# Altium project DAQ-2-B.PrjPcb
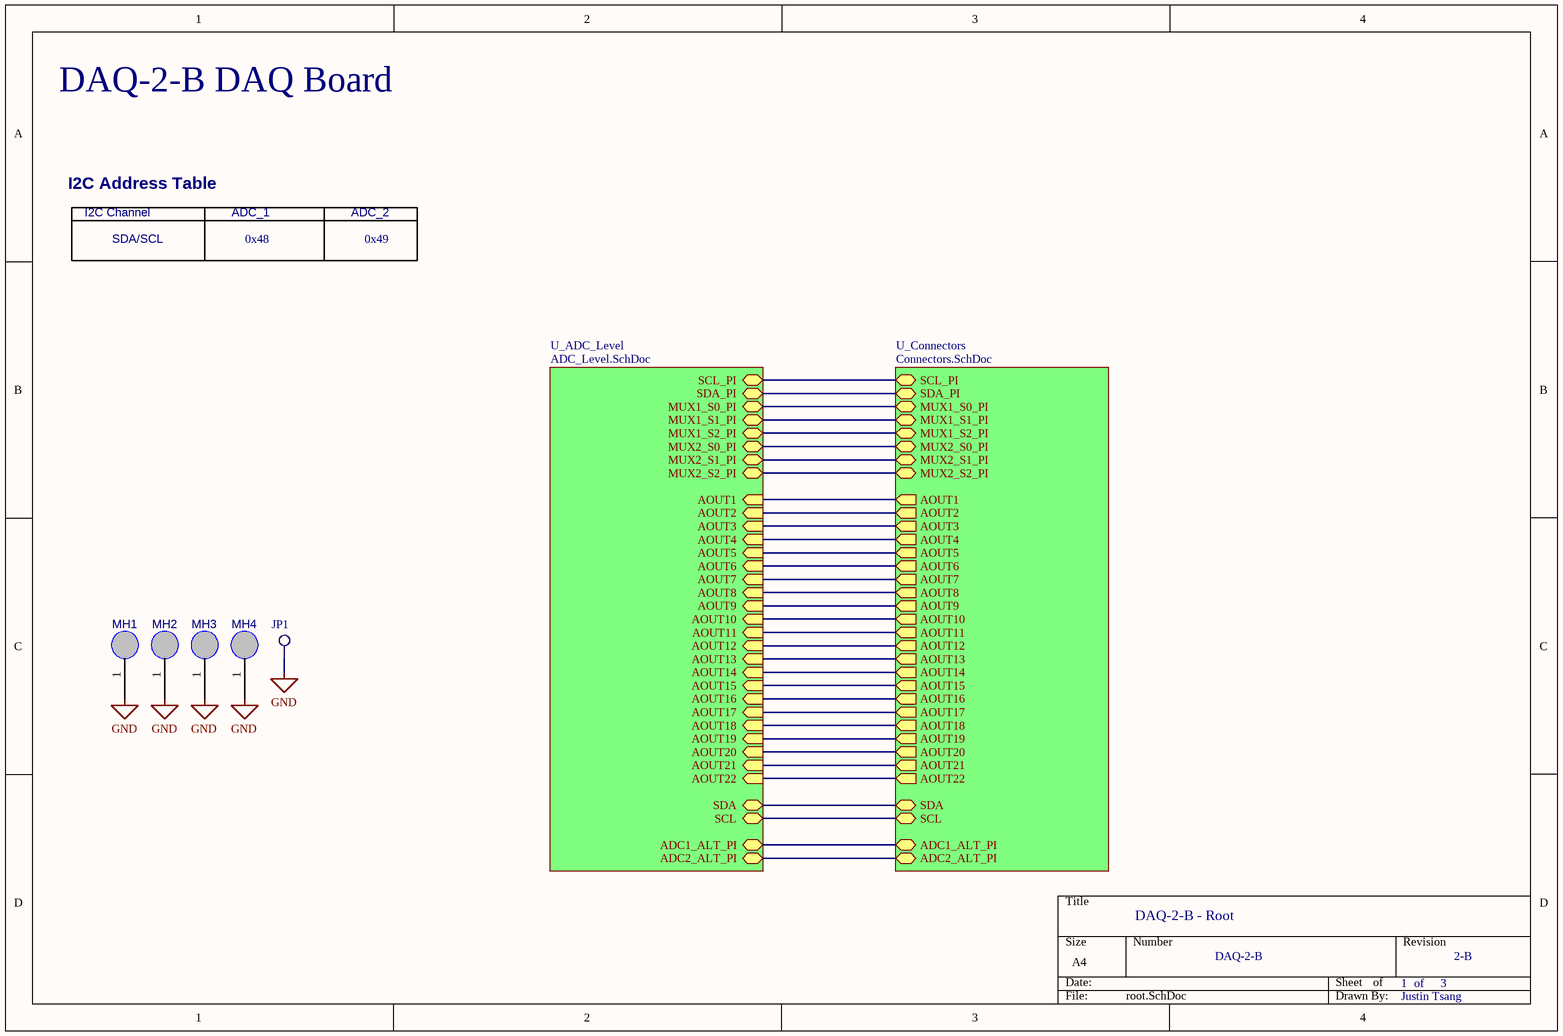
[diagram p0: root.SchDoc]
3 sheets, 79 parts. Net scope: hierarchical (ports join the sheet entries above them; power ports are global).
Board file: DAQ-2-B.PcbDoc
Sheets:
  root.SchDoc
    U_ADC_Level = ADC_Level.SchDoc
    U_Connectors = Connectors.SchDoc

## Sheet root.SchDoc
size A4; SheetNumber: 1; SheetTotal: 3

### Parts
JP1  Testpoint2  [TP2]  (value not drawn)
MH1  MountingHole  [MH2.7MM]  (value not drawn)
MH2  MountingHole  [MH2.7MM]  (value not drawn)
MH3  MountingHole  [MH2.7MM]  (value not drawn)
MH4  MountingHole  [MH2.7MM]  (value not drawn)

### Sub-sheets
U_ADC_Level = ADC_Level.SchDoc: SCL_PI (bidir), SDA_PI (bidir), MUX1_S0_PI (bidir), MUX1_S1_PI (bidir), MUX1_S2_PI (bidir), MUX2_S0_PI (bidir), MUX2_S1_PI (bidir), MUX2_S2_PI (bidir), AOUT17 (in), AOUT14 (in), AOUT7 (in), AOUT8 (in), AOUT16 (in), AOUT18 (in), AOUT9 (in), AOUT6 (in), AOUT12 (in), AOUT10 (in), AOUT19 (in), AOUT13 (in), AOUT1 (in), AOUT15 (in), AOUT20 (in), AOUT2 (in), AOUT3 (in), AOUT11 (in), AOUT5 (in), AOUT4 (in), SCL (bidir), SDA (bidir), AOUT21 (in), AOUT22 (in), ADC1_ALT_PI (bidir), ADC2_ALT_PI (bidir)
U_Connectors = Connectors.SchDoc: SCL_PI (bidir), SDA_PI (bidir), MUX1_S0_PI (bidir), MUX1_S1_PI (bidir), MUX1_S2_PI (bidir), MUX2_S0_PI (bidir), MUX2_S1_PI (bidir), MUX2_S2_PI (bidir), AOUT1 (out), AOUT2 (out), AOUT3 (out), AOUT4 (out), AOUT5 (out), AOUT6 (out), AOUT7 (out), AOUT8 (out), AOUT9 (out), AOUT10 (out), AOUT11 (out), AOUT12 (out), AOUT13 (out), AOUT14 (out), AOUT15 (out), AOUT16 (out), AOUT18 (out), AOUT19 (out), AOUT20 (out), AOUT17 (out), SCL (bidir), SDA (bidir), AOUT22 (out), AOUT21 (out), ADC1_ALT_PI (bidir), ADC2_ALT_PI (bidir)

### Nets
GND: JP1.1 MH1.1 MH2.1 MH3.1 MH4.1
SCL: sheet U_ADC_Level/SDA, sheet U_Connectors/SDA
SDA: sheet U_ADC_Level/SCL, sheet U_Connectors/SCL
NetJ2_3: sheet U_ADC_Level/SDA_PI, sheet U_Connectors/SDA_PI
NetJ2_5: sheet U_ADC_Level/SCL_PI, sheet U_Connectors/SCL_PI
NetJ2_15: sheet U_ADC_Level/MUX2_S0_PI, sheet U_Connectors/MUX2_S0_PI
NetJ2_16: sheet U_ADC_Level/MUX2_S1_PI, sheet U_Connectors/MUX2_S1_PI
NetJ2_18: sheet U_ADC_Level/MUX2_S2_PI, sheet U_Connectors/MUX2_S2_PI
NetJ2_31: sheet U_ADC_Level/MUX1_S1_PI, sheet U_Connectors/MUX1_S1_PI
NetJ2_32: sheet U_ADC_Level/MUX1_S2_PI, sheet U_Connectors/MUX1_S2_PI
NetJ2_36: sheet U_ADC_Level/MUX1_S0_PI, sheet U_Connectors/MUX1_S0_PI
NetJ3_3: sheet U_ADC_Level/AOUT1, sheet U_Connectors/AOUT1
NetJ4_3: sheet U_ADC_Level/AOUT2, sheet U_Connectors/AOUT2
NetJ5_3: sheet U_ADC_Level/AOUT3, sheet U_Connectors/AOUT3
NetJ6_3: sheet U_ADC_Level/AOUT4, sheet U_Connectors/AOUT4
NetJ7_3: sheet U_ADC_Level/AOUT5, sheet U_Connectors/AOUT5
NetJ8_3: sheet U_ADC_Level/AOUT6, sheet U_Connectors/AOUT6
NetJ9_3: sheet U_ADC_Level/AOUT7, sheet U_Connectors/AOUT7
NetJ10_3: sheet U_ADC_Level/AOUT8, sheet U_Connectors/AOUT8
NetJ11_3: sheet U_ADC_Level/AOUT9, sheet U_Connectors/AOUT9
NetJ12_3: sheet U_ADC_Level/AOUT10, sheet U_Connectors/AOUT10
NetJ13_3: sheet U_ADC_Level/AOUT11, sheet U_Connectors/AOUT11
NetJ14_3: sheet U_ADC_Level/AOUT12, sheet U_Connectors/AOUT12
NetJ15_3: sheet U_ADC_Level/AOUT13, sheet U_Connectors/AOUT13
NetJ16_3: sheet U_ADC_Level/AOUT14, sheet U_Connectors/AOUT14
NetJ17_3: sheet U_ADC_Level/AOUT15, sheet U_Connectors/AOUT15
NetJ18_3: sheet U_ADC_Level/AOUT16, sheet U_Connectors/AOUT16
NetJ19_3: sheet U_ADC_Level/AOUT17, sheet U_Connectors/AOUT17
NetJ20_3: sheet U_ADC_Level/AOUT18, sheet U_Connectors/AOUT18
NetJ21_3: sheet U_ADC_Level/AOUT19, sheet U_Connectors/AOUT19
NetJ22_3: sheet U_ADC_Level/AOUT20, sheet U_Connectors/AOUT20
NetJ23_1: sheet U_ADC_Level/AOUT21, sheet U_Connectors/AOUT21
NetJ24_1: sheet U_ADC_Level/AOUT22, sheet U_Connectors/AOUT22
NetJP10_2: sheet U_ADC_Level/ADC2_ALT_PI, sheet U_Connectors/ADC2_ALT_PI
NetJP13_2: sheet U_ADC_Level/ADC1_ALT_PI, sheet U_Connectors/ADC1_ALT_PI

### Notes on the sheet
- DAQ-2-B DAQ Board
- I2C Channel
- SDA/SCL
- I2C Address Table
- 0x48
- ADC_1
- 0x49
- ADC_2
- DAQ-2-B - Root
- DAQ-2-B
- of
- 2-B
- Justin Tsang

### Library data of the parts
JP1 = Testpoint2: Single layer pad TP
MH1-MH4 = MH2.75mm: Mounting hole, 2.7mm; Case: TH

## Sheet ADC_Level.SchDoc
size A4; SheetNumber: 2; SheetTotal: 3
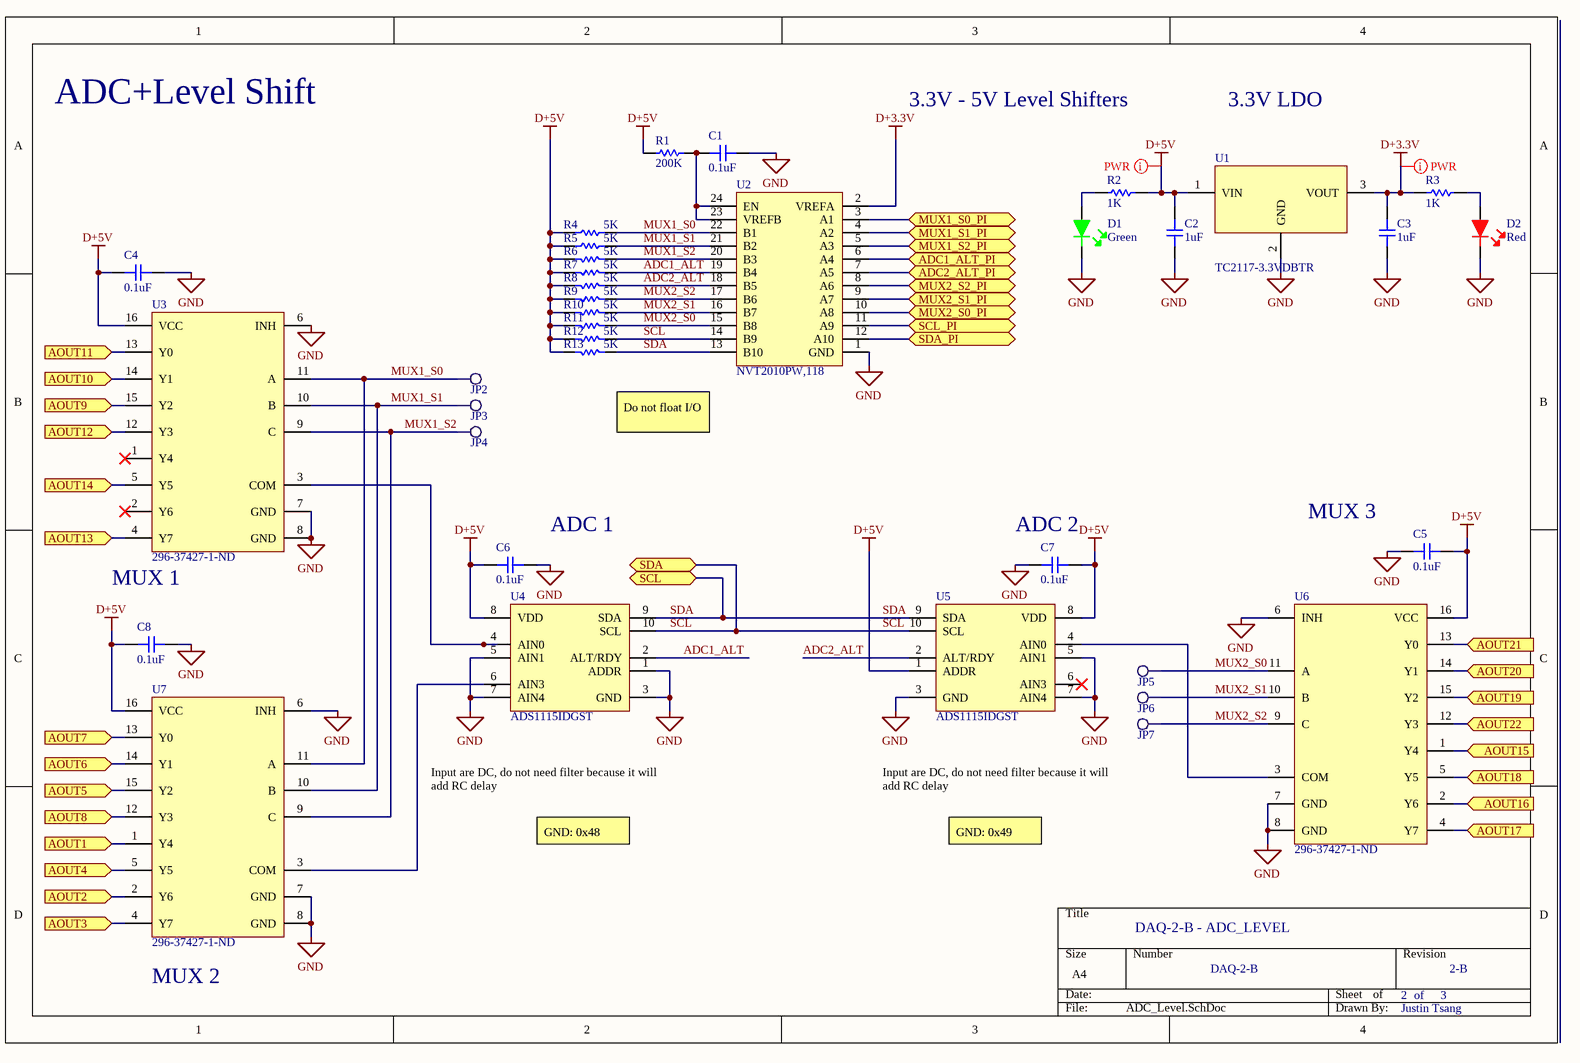
[diagram p1: ADC_Level.SchDoc]

### Parts
C1  0.1uF  [CAP-0603]
C2  1uF  [CAP-0603]
C3  1uF  [CAP-0603]
C4  0.1uF  [CAP-0603]
C5  0.1uF  [CAP-0603]
C6  0.1uF  [CAP-0603]
C7  0.1uF  [CAP-0603]
C8  0.1uF  [CAP-0603]
D1  Green  [LED-0603]
D2  Red  [LED-0603]
JP2  Testpoint2  [TP2]  (value not drawn)
JP3  Testpoint2  [TP2]  (value not drawn)
JP4  Testpoint2  [TP2]  (value not drawn)
JP5  Testpoint2  [TP2]  (value not drawn)
JP6  Testpoint2  [TP2]  (value not drawn)
JP7  Testpoint2  [TP2]  (value not drawn)
R1  200K  [RES-0603]
R2  1K  [RES-0603]
R3  1K  [RES-0603]
R4  5K  [RES-0603]
R5  5K  [RES-0603]
R6  5K  [RES-0603]
R7  5K  [RES-0603]
R8  5K  [RES-0603]
R9  5K  [RES-0603]
R10  5K  [RES-0603]
R11  5K  [RES-0603]
R12  5K  [RES-0603]
R13  5K  [RES-0603]
U1  TC2117-3.3VDBTR  [SOT223]
U2  NVT2010PW,118  [TSSOP65P660X110-24]
U3  296-37427-1-ND  [16-SOIC]
U4  ADS1115IDGST  [VSSOP50P310X310-10P]
U5  ADS1115IDGST  [VSSOP50P310X310-10P]
U6  296-37427-1-ND  [16-SOIC]
U7  296-37427-1-ND  [16-SOIC]

### Ports
ADC1_ALT_PI (bidir), ADC2_ALT_PI (bidir), AOUT1 (in), AOUT2 (in), AOUT3 (in), AOUT4 (in), AOUT5 (in), AOUT6 (in), AOUT7 (in), AOUT8 (in), AOUT9 (in), AOUT10 (in), AOUT11 (in), AOUT12 (in), AOUT13 (in), AOUT14 (in), AOUT15 (in), AOUT16 (in), AOUT17 (in), AOUT18 (in), AOUT19 (in), AOUT20 (in), AOUT21 (in), AOUT22 (in), MUX1_S0_PI (bidir), MUX1_S1_PI (bidir), MUX1_S2_PI (bidir), MUX2_S0_PI (bidir), MUX2_S1_PI (bidir), MUX2_S2_PI (bidir), SCL (bidir), SCL_PI (bidir), SDA (bidir), SDA_PI (bidir)

### Nets
D+3.3V: C3.2 R3.1 U1.3(VOUT) U2.2(VREFA)
D+5V: C2.2 C4.2 C5.2 C6.2 C7.2 C8.2 R1.2 R2.1 R4.1 R5.1 R6.1 R7.1 R8.1 R9.1 R10.1 R11.1 R12.2 R13.1 U1.1(VIN) U3.16(VCC) U4.8(VDD) U5.1(ADDR) U5.8(VDD) U6.16(VCC) U7.16(VCC)
GND: C1.1 C2.1 C3.1 C4.1 C5.1 C6.1 C7.1 C8.1 D1.2 D2.2 U1.2(GND) U2.1(GND) U3.6(INH) U3.7(GND) U3.8(GND) U4.1(ADDR) U4.3(GND) U4.5(AIN1) U4.7(AIN4) U5.3(GND) U5.5(AIN1) U5.7(AIN4) U6.6(INH) U6.7(GND) U6.8(GND) U7.6(INH) U7.7(GND) U7.8(GND)
ADC1_ALT: R7.2 U2.19(B4) U4.2(ALT/RDY)
ADC2_ALT: R8.2 U2.18(B5) U5.2(ALT/RDY)
MUX1_S0: JP2.1 R4.2 U2.22(B1) U3.11(A) U7.11(A)
MUX1_S1: JP3.1 R5.2 U2.21(B2) U3.10(B) U7.10(B)
MUX1_S2: JP4.1 R6.2 U2.20(B3) U3.9(C) U7.9(C)
MUX2_S0: JP5.1 R11.2 U2.15(B8) U6.11(A)
MUX2_S1: JP6.1 R10.2 U2.16(B7) U6.10(B)
MUX2_S2: JP7.1 R9.2 U2.17(B6) U6.9(C)
SCL: R12.1 U2.14(B9) U4.10(SCL) U5.10(SCL) ; port SDA
SDA: R13.2 U2.13(B10) U4.9(SDA) U5.9(SDA) ; port SCL
NetC1_2: C1.2 R1.1 U2.23(VREFB) U2.24(EN)
NetD1_1: D1.1 R2.2
NetD2_1: D2.1 R3.2
NetJ2_3: U2.12(A10) ; port SDA_PI
NetJ2_5: U2.11(A9) ; port SCL_PI
NetJ2_15: U2.10(A8) ; port MUX2_S0_PI
NetJ2_16: U2.9(A7) ; port MUX2_S1_PI
NetJ2_18: U2.8(A6) ; port MUX2_S2_PI
NetJ2_31: U2.4(A2) ; port MUX1_S1_PI
NetJ2_32: U2.5(A3) ; port MUX1_S2_PI
NetJ2_36: U2.3(A1) ; port MUX1_S0_PI
NetJ3_3: U7.1(Y4) ; port AOUT1
NetJ4_3: U7.2(Y6) ; port AOUT2
NetJ5_3: U7.4(Y7) ; port AOUT3
NetJ6_3: U7.5(Y5) ; port AOUT4
NetJ7_3: U7.15(Y2) ; port AOUT5
NetJ8_3: U7.14(Y1) ; port AOUT6
NetJ9_3: U7.13(Y0) ; port AOUT7
NetJ10_3: U7.12(Y3) ; port AOUT8
NetJ11_3: U3.15(Y2) ; port AOUT9
NetJ12_3: U3.14(Y1) ; port AOUT10
NetJ13_3: U3.13(Y0) ; port AOUT11
NetJ14_3: U3.12(Y3) ; port AOUT12
NetJ15_3: U3.4(Y7) ; port AOUT13
NetJ16_3: U3.5(Y5) ; port AOUT14
NetJ17_3: U6.1(Y4) ; port AOUT15
NetJ18_3: U6.2(Y6) ; port AOUT16
NetJ19_3: U6.4(Y7) ; port AOUT17
NetJ20_3: U6.5(Y5) ; port AOUT18
NetJ21_3: U6.15(Y2) ; port AOUT19
NetJ22_3: U6.14(Y1) ; port AOUT20
NetJ23_1: U6.13(Y0) ; port AOUT21
NetJ24_1: U6.12(Y3) ; port AOUT22
NetJP10_2: U2.7(A5) ; port ADC2_ALT_PI
NetJP13_2: U2.6(A4) ; port ADC1_ALT_PI
NetU3_3: U3.3(COM) U4.4(AIN0)
NetU4_6: U4.6(AIN3) U7.3(COM)
NetU5_4: U5.4(AIN0) U6.3(COM)

Not connected (* = marked no-connect by the designer): U3 1(Y4)* 2(Y6)*; U5 6(AIN3)*

### Layout directives
mark named PWR: D+3.3V, D+5V

### Notes on the sheet
- ADC+Level Shift
- 3.3V - 5V Level Shifters
- 3.3V LDO
- Do not float I/O
- MUX 3
- (near U3) MUX 1
- (near C6) ADC 1
- (near C7) ADC 2
- Input are DC, do not need filter because it will add RC delay
- GND: 0x48
- GND: 0x49
- DAQ-2-B - ADC_LEVEL
- (near U7) MUX 2
- DAQ-2-B
- of
- 2-B
- Justin Tsang

### Library data of the parts
C1 C4-C8 = 0603-0.1uF-16V: CAP CER 0.1UF 16V X7R 0603; Manufacturer: KEMET; Manufacturer Part Number: C0603C104M4RACTU; Dielectric Material: Ceramic; Capacitance: 100nF; Tolerance: 20%; Supplier 1: Digi-Key; Stock 1: 254524; Pricing 1: 1=0.1, 10=0.036, 100=0.0161, 500=0.01152, 1000=0.00904 (USD); Mount: Surface Mount,PCB; Case/Package: 0603; Number of Pins: 2; Case Code (Metric): 1608; Case Code (Imperial): 0603; Min Operating Temperature: -55°C; Max Operating Temperature: 125°C; Package Quantity: 1; Voltage Rating: 16V; Packaging: Tape and Reel; Voltage Rating (DC): 16V; Dielectric: X7R; Termination: SMD/SMT; Length: 1.6mm; Height: 0.8mm; Width: 0.031inch; Thickness: 0.034inch; Lead Pitch: 0.7mm; Depth: 0.8mm; Radiation Hardening: No; REACH SVHC: No SVHC; ComponentLink1URL: https://www.verical.com/server-webapp/html/getDatasheet?partID=66190&src-supplier=Verical; ComponentLink1Description: https://www.verical.com/server-webapp/html/getDatasheet?partID=66190&src-supplier=Verical; ComponentLink2URL: http://www.farnell.com/datasheets/2746055.pdf?src-supplier=Element14; ComponentLink2Description: http://www.farnell.com/datasheets/2746055.pdf?src-supplier=Element14; ComponentLink3URL: http://www.farnell.com/datasheets/2123765.pdf?src-supplier=Element14; ComponentLink3Description: http://www.farnell.com/datasheets/2123765.pdf?src-supplier=Element14; ComponentLink4URL: http://www.alliedelec.com/m/d/9bfe7773041ffe9d406e68bc7b377fdd.pdf?src-supplier=Allied+Electronics; ComponentLink4Description: http://www.alliedelec.com/m/d/9bfe7773041ffe9d406e68bc7b377fdd.pdf?src-supplier=Allied+Electronics; ComponentLink5URL: https://www.verical.com/server-webapp/html/getDatasheet?partID=302288&src-supplier=Verical; ComponentLink5Description: https://www.verical.com/server-webapp/html/getDatasheet?partID=302288&src-supplier=Verical; Supplier Part Number 1: 399-1099-6-ND
C2 C3 = 0603-1uF-16V: CAP CER 1UF 16V X7R 0603; Manufacturer: KEMET; Manufacturer Part Number: C0603C105K4RACTU; Dielectric Material: Ceramic; Tolerance: 10%; Dissipation Factor: 3.5%; Supplier 1: Digi-Key; Stock 1: 600463; Pricing 1: 1=0.12, 10=0.088, 100=0.0391, 500=0.02792, 1000=0.02193 (USD); Mount: Surface Mount,PCB; Case/Package: 0603; Number of Pins: 2; Case Code (Metric): 1608; Case Code (Imperial): 0603; Contact Plating: Tin,Matte; Min Operating Temperature: -55°C; Max Operating Temperature: 125°C; Package Quantity: 4000; Capacitance: 1uF; Voltage Rating: 16V; Packaging: Tape and Reel; Voltage Rating (DC): 16V; Dielectric: X7R; Termination: SMD/SMT; Voltage: 16V; Length: 1.6mm; Height: 0.8mm; Width: 0.031inch; Thickness: 0.034inch; Depth: 0.8mm; Radiation Hardening: No; REACH SVHC: No SVHC; ComponentLink1URL: http://www.mouser.com/ds/2/212/KEM_C1002_X7R_SMD-1102033.pdf?src-supplier=Mouser; ComponentLink1Description: http://www.mouser.com/ds/2/212/KEM_C1002_X7R_SMD-1102033.pdf?src-supplier=Mouser; ComponentLink2URL: http://www.kemet.com/kemet/web/homepage/kechome.nsf/file/Commercial%20Ceramic%20Chips%20X7R%20Dielectric/$file/KEM_C1002_X7R_SMD.pdf?src-supplier=Element14; ComponentLink2Description: http://www.kemet.com/kemet/web/homepage/kechome.nsf/file/Commercial%20Ceramic%20Chips%20X7R%20Dielectric/$file/KEM_C1002_X7R_SMD.pdf?src-supplier=Element14; ComponentLink3URL: https://www.verical.com/server-webapp/html/getDatasheet?partID=385479&src-supplier=Verical; ComponentLink3Description: https://www.verical.com/server-webapp/html/getDatasheet?partID=385479&src-supplier=Verical; ComponentLink4URL: http://www.kemet.com/kemet/web/homepage/kechome.nsf/vapubfiles/KEM_C1002_X7R_SMD.pdf/$file/KEM_C1002_X7R_SMD.pdf?src-supplier=Element14; ComponentLink4Description: http://www.kemet.com/kemet/web/homepage/kechome.nsf/vapubfiles/KEM_C1002_X7R_SMD.pdf/$file/KEM_C1002_X7R_SMD.pdf?src-supplier=Element14; Supplier Part Number 1: 399-7847-6-ND
D1 = LED-Green: LED GREEN CLEAR 0603 SMD; Manufacturer: Wurth Electronics; Manufacturer Part Number: 150060VS75000; Luminous Intensity: 40mcd; Viewing Angle: 140°; Forward Voltage: 2V; Wavelength: 570nm; Lens Style: Clear,Rectangular; Forward Current: 30mA; Test Current: 20mA; Supplier 1: Digi-Key; Stock 1: 118118; Pricing 1: 1=0.14, 50=0.133, 100=0.114, 500=0.099 (USD); Mount: Surface Mount; Case/Package: 0603; Number of Pins: 2; Color: Green; Case Code (Metric): 1608; Case Code (Imperial): 0603; Min Operating Temperature: -40°C; Max Operating Temperature: 85°C; Package Quantity: 1; Packaging: Tape and Reel; Dominant Wavelength: 570nm; Length: 1.6mm; Height: 0.7mm; Width: 0.8mm; REACH SVHC: Unknown; ComponentLink1URL: https://katalog.we-online.de/led/datasheet/150060VS75000.pdf?src-supplier=Digi-Key; ComponentLink1Description: https://katalog.we-online.de/led/datasheet/150060VS75000.pdf?src-supplier=Digi-Key; Supplier Part Number 1: 732-4980-1-ND
D2 = LED-Red: LED RED CLEAR 0603 SMD; Manufacturer: Wurth Electronics; Manufacturer Part Number: 150060RS75000; Viewing Angle: 140°; Lens Style: Clear,Rectangular; Luminous Intensity: 250mcd; Forward Current: 30mA; Forward Voltage: 2V; Wavelength: 625nm; Test Current: 20mA; Supplier 1: Digi-Key; Stock 1: 18518; Pricing 1: 1=0.14, 50=0.133, 100=0.114, 500=0.099 (USD); Mount: Surface Mount; Case/Package: 0603; Color: Red; Case Code (Metric): 1608; Case Code (Imperial): 0603; Min Operating Temperature: -40°C; Max Operating Temperature: 85°C; Package Quantity: 1; Packaging: Cut Tape; Dominant Wavelength: 625nm; Length: 1.6mm; Height: 0.7mm; Width: 0.8mm; REACH SVHC: Unknown; ComponentLink1URL: https://katalog.we-online.de/led/datasheet/150060RS75000.pdf?src-supplier=Digi-Key; ComponentLink1Description: https://katalog.we-online.de/led/datasheet/150060RS75000.pdf?src-supplier=Digi-Key; ComponentLink2URL: http://www.produktinfo.conrad.com/datenblaetter/750000-774999/759428-da-01-en-CHIPLED_0603_W_KL_ROT_150060RS75000.pdf?src-supplier=Conrad; ComponentLink2Description: http://www.produktinfo.conrad.com/datenblaetter/750000-774999/759428-da-01-en-CHIPLED_0603_W_KL_ROT_150060RS75000.pdf?src-supplier=Conrad; Supplier Part Number 1: 732-4978-6-ND
JP2-JP7 = Testpoint2: Single layer pad TP
R1 = 0603-200KR: RES SMD 200K OHM 1% 1/10W 0603; Supplier 1: Digi-Key; Supplier Part Number 1: RMCF0603FT200KCT-ND
R2 R3 = 0603-1KR: RES SMD 1K OHM 1% 1/10W 0603; Manufacturer: Vishay Dale; Manufacturer Part Number: CRCW06031K00FKEA; Resistance: 1kR; Power Rating: 100mW; Voltage Rating: 75V; Temperature Coefficient: 100ppm/°C; Supplier 1: Digi-Key; Stock 1: 671453; Pricing 1: 1=0.1, 10=0.034, 100=0.0139, 1000=0.00623, 2500=0.0054 (USD); Mount: Surface Mount; Case/Package: 0603; Number of Pins: 2; Weight: 7.1E-05oz; Case Code (Metric): 1608; Case Code (Imperial): 0603; Contact Plating: Tin; Min Operating Temperature: -55°C; Max Operating Temperature: 155°C; Composition: Thick Film; Tolerance: 1%; Packaging: Tape and Reel; Package Quantity: 10; Number of Terminations: 2; Termination: SMD/SMT; Military Standard: Not; Max Power Dissipation: 100mW; Voltage Rating (DC): 75V; Features: Automotive AEC-Q200; Length: 1.55mm; Height: 0.45mm; Width: 0.033inch; Depth: 0.85mm; Radiation Hardening: No; REACH SVHC: Unknown; Lead Free: Lead Free; ComponentLink1URL: http://www.vishay.com/docs/20035/dcrcwe3.pdf?src-supplier=Digi-Key; ComponentLink1Description: http://www.vishay.com/docs/20035/dcrcwe3.pdf?src-supplier=Digi-Key; ComponentLink2URL: http://uk.rs-online.com/webdocs/0d98/0900766b80d98afc.pdf?src-supplier=RSComponents; ComponentLink2Description: http://uk.rs-online.com/webdocs/0d98/0900766b80d98afc.pdf?src-supplier=RSComponents; ComponentLink3URL: http://www.vishay.com/docs/20035/dcrcwe3.pdf?src-supplier=Avnet; ComponentLink3Description: http://www.vishay.com/docs/20035/dcrcwe3.pdf?src-supplier=Avnet; ComponentLink4URL: http://www.vishay.com/docs/20035/dcrcwe3.pdf?src-supplier=Avnet+Asia; ComponentLink4Description: http://www.vishay.com/docs/20035/dcrcwe3.pdf?src-supplier=Avnet+Asia; ComponentLink5URL: http://www.farnell.com/datasheets/2310790.pdf?src-supplier=Element14; ComponentLink5Description: http://www.farnell.com/datasheets/2310790.pdf?src-supplier=Element14; ComponentLink6URL: https://www.distrelec.biz/Web/Downloads/a_/en/flD-CRCW-e3_data_en.pdf?mime=application%2Fpdf&src-supplier=Distrelec; ComponentLink6Description: https://www.distrelec.biz/Web/Downloads/a_/en/flD-CRCW-e3_data_en.pdf?mime=application%2Fpdf&src-supplier=Distrelec; ComponentLink7URL: http://www.vishay.com/docs/20035/dcrcwe3.pdf?src-supplier=Future+Electronics; ComponentLink7Description: http://www.vishay.com/docs/20035/dcrcwe3.pdf?src-supplier=Future+Electronics; ComponentLink8URL: http://www.vishay.com/docs/20035/dcrcwe3.pdf?src-supplier=Avnet+Europe; ComponentLink8Description: http://www.vishay.com/docs/20035/dcrcwe3.pdf?src-supplier=Avnet+Europe; Supplier Part Number 1: 541-1.00KHCT-ND
R4-R13 = 0603-5KR: RES SMD 4.99K OHM 1% 1/10W 0603; Manufacturer: Bourns; Manufacturer Part Number: CR0603-FX-4991ELF; Resistance: 4.99kR; Power Rating: 100mW; Voltage Rating: 50V; Temperature Coefficient: 100ppm/°C; Supplier 1: Digi-Key; Stock 1: 70557; Pricing 1: 1=0.1, 10=0.02, 25=0.0144, 50=0.011, 100=0.0082, 250=0.00624, 500=0.00498, 1000=0.00367 (USD); Mount: Surface Mount; Case/Package: 0603; Case Code (Imperial): 0603; Case Code (Metric): 1608; Contact Plating: Tin; Min Operating Temperature: -55°C; Max Operating Temperature: 155°C; Tolerance: 1%; Packaging: Tape and Reel; Package Quantity: 1; Composition: Thick Film; Termination: SMD/SMT; Number of Terminations: 2; Max Power Dissipation: 100mW; Features: Moisture Resistant; Length: 0.063inch; Height: 0.022inch; Width: 0.8mm; Thickness: 457um; Radiation Hardening: No; ComponentLink1URL: https://www.bourns.com/docs/Product-Datasheets/CHPREZTR.pdf?src-supplier=Digi-Key; ComponentLink1Description: https://www.bourns.com/docs/Product-Datasheets/CHPREZTR.pdf?src-supplier=Digi-Key; ComponentLink2URL: http://www.bourns.com/pdfs/chpreztr.pdf?src-supplier=Avnet; ComponentLink2Description: http://www.bourns.com/pdfs/chpreztr.pdf?src-supplier=Avnet; Supplier Part Number 1: CR0603-FX-4991ELFDKR-ND
U1 = LDO-3.3V-800mA: IC REG LIN 3.3V 800MA SOT223-3; Manufacturer: Microchip; Dropout Voltage: 1.2V; Max Input Voltage: 6V; Min Input Voltage: 2.7V; Number of Outputs: 1; Polarity: Positive; Accuracy: 0.5%; Quiescent Current: 80uA; Output Type: Fixed; Supplier 1: Digi-Key; Manufacturer Part Number: TC2117-3.3VDBTR; Stock 1: 3126; Pricing 1: 1=0.73, 25=0.61, 100=0.55 (USD); Mount: Surface Mount; Case/Package: SOT-223-3; Number of Pins: 3; Min Operating Temperature: -40°C; Max Operating Temperature: 125°C; Output Current: 800mA; Max Output Current: 800mA; Output Voltage: 3.3V; Max Supply Voltage: 6V; Min Supply Voltage: 2.7V; Package Quantity: 4000; Packaging: Tape and Reel; Nominal Output Voltage: 3.3V; Number of Regulators: 1; Min Output Voltage: 3.3V; Max Output Voltage: 3.3V; Termination: SMD/SMT; Length: 6.7mm; Height: 1.7mm; Width: 3.7mm; Radiation Hardening: No; REACH SVHC: No SVHC; Lead Free: Lead Free; ComponentLink1URL: http://www.farnell.com/datasheets/1669439.pdf?src-supplier=Element14; ComponentLink1Description: http://www.farnell.com/datasheets/1669439.pdf?src-supplier=Element14; ComponentLink2URL: http://ww1.microchip.com/downloads/en/DeviceDoc/21665D.pdf?src-supplier=Avnet+Europe; ComponentLink2Description: http://ww1.microchip.com/downloads/en/DeviceDoc/21665D.pdf?src-supplier=Avnet+Europe; ComponentLink3URL: http://www.microchip.com/mymicrochip/filehandler.aspx?ddocname=en023833&src-supplier=Digi-Key; ComponentLink3Description: http://www.microchip.com/mymicrochip/filehandler.aspx?ddocname=en023833&src-supplier=Digi-Key; ComponentLink4URL: http://ww1.microchip.com/downloads/en/DeviceDoc/21665D.pdf?src-supplier=Future+Electronics; ComponentLink4Description: http://ww1.microchip.com/downloads/en/DeviceDoc/21665D.pdf?src-supplier=Future+Electronics; ComponentLink5URL: http://ww1.microchip.com/downloads/en/DeviceDoc/21665D.pdf?src-supplier=Avnet; ComponentLink5Description: http://ww1.microchip.com/downloads/en/DeviceDoc/21665D.pdf?src-supplier=Avnet; ComponentLink6URL: http://www.farnell.com/datasheets/1669439.pdf?src-supplier=Newark; ComponentLink6Description: http://www.farnell.com/datasheets/1669439.pdf?src-supplier=Newark; Supplier Part Number 1: TC2117-3.3VDBDKR-ND
U2 = IC_NVT2010PW: NVT2010PW/TSSOP24/REEL13//; Manufacturer: NXP Semiconductors; Max Supply Voltage: 5.5V; Min Supply Voltage: 1V; Number of Channels: 10; Propagation Delay: 1.5ns; Logic Function: Translator; Output Type: Voltage; Supplier 1: Digi-Key; Manufacturer Part Number: NVT2010PW,118; RoHS: Yes; Category: Interface ICs; Stock 1: 3117; Pricing 1: 1=1.02000, 10=0.91600, 25=0.86920, 100=0.83480 (USD); Mount: Surface Mount; Case/Package: TSSOP; Number of Pins: 24; Min Operating Temperature: -40°C; Max Operating Temperature: 85°C; Packaging: Tape and Reel; Package Quantity: 1; Number of Bits: 10; Turn-On Delay Time: 1.5ns; Series: -; Radiation Hardening: No; Lead Free: Lead Free; RoHS Compliant: Yes; ComponentLink1URL: https://datasheet.ciiva.com/1899/nvt2008-nvt2010-1899186.pdf?src-supplier=Digi-Key; ComponentLink1Description: https://datasheet.ciiva.com/1899/nvt2008-nvt2010-1899186.pdf?src-supplier=Digi-Key; ComponentLink2URL: https://datasheet.ciiva.com/1899/nvt2008-nvt2010-1899187.pdf?src-supplier=Digi-Key; ComponentLink2Description: https://datasheet.ciiva.com/1899/nvt2008-nvt2010-1899187.pdf?src-supplier=Digi-Key; ComponentLink3URL: https://datasheet.ciiva.com/8244/nvt2008-nvt2010-8244294.pdf?src-supplier=Avnet; ComponentLink3Description: https://datasheet.ciiva.com/8244/nvt2008-nvt2010-8244294.pdf?src-supplier=Avnet; ComponentLink4URL: https://datasheet.ciiva.com/1899/nvt2008-nvt2010-1899185.pdf?src-supplier=Digi-Key; ComponentLink4Description: https://datasheet.ciiva.com/1899/nvt2008-nvt2010-1899185.pdf?src-supplier=Digi-Key; Supplier Part Number 1: 568-5299-1-ND
U3 U6 U7 = MUX-SN74LV4051ATDWRQ1: IC MUX/DEMUX 8X1 16SOIC; Manufacturer: Texas Instruments; Max Supply Voltage: 5.5V; Min Supply Voltage: 2V; Bandwidth: 35MHz; Propagation Delay: 7ns; Number of Inputs: 8; Number of Outputs: 1; Logic Function: Multiplexer,Demultiplexer; On-State Resistance: 75R; Operating Supply Current: 20uA; Turn-On Delay Time: 20ns; Supply Type: Single; Supplier 1: Digi-Key; Manufacturer Part Number: SN74LV4051ATDWRQ1; Stock 1: 2359; Pricing 1: 1=0.7, 10=0.617, 25=0.5796, 100=0.4731, 250=0.43944, 500=0.374, 1000=0.2992 (USD); Mount: Surface Mount; Case/Package: SOIC; Number of Pins: 16; Weight: 0.014829oz; Min Operating Temperature: -40°C; Max Operating Temperature: 105°C; Packaging: Tape and Reel; Package Quantity: 2000; Number of Channels: 1; Turn-Off Delay Time: 20ns; Number of Circuits: 1; -3db Bandwidth: 35MHz; Number of Bits: 8; Radiation Hardening: No; Lead Free: Lead Free; ComponentLink1URL: https://www.verical.com/server-webapp/html/getDatasheet?partID=348177&src-supplier=Verical; ComponentLink1Description: https://www.verical.com/server-webapp/html/getDatasheet?partID=348177&src-supplier=Verical; ComponentLink2URL: http://focus.ti.com/lit/ds/symlink/sn74lv4051a-q1.pdf?src-supplier=Avnet; ComponentLink2Description: http://focus.ti.com/lit/ds/symlink/sn74lv4051a-q1.pdf?src-supplier=Avnet; ComponentLink3URL: http://www.ti.com/lit/ds/symlink/sn74lv4051a-q1.pdf?src-supplier=Digi-Key; ComponentLink3Description: http://www.ti.com/lit/ds/symlink/sn74lv4051a-q1.pdf?src-supplier=Digi-Key; Supplier Part Number 1: 296-37427-6-ND
U4 U5 = IC_ADS1115: TEXAS INSTRUMENTS - ADS1115IDGST . - Analogue to Digital Converter, 16 bit, 860 SPS, Differential, Single Ended, I2C, Single, 2 V; Sampling Rate: 860S/s; Number of A/D Converters: 1; Number of Bits: 16; Resolution: 16b; Polarity: Bipolar; Number of Inputs: 4; Min Supply Voltage: 2V; Max Supply Voltage: 5.5V; Conversion Rate: 0.86KS/s; Integral Nonlinearity (INL): 1LSB; Power Dissipation: 900uW; Supplier 1: Digi-Key; Manufacturer: Texas Instruments; RoHS: Yes; Category: Analog to Digital Converters (ADCs); Stock 1: 7435; Pricing 1: 1=5.62000, 10=5.04600, 25=4.77000, 100=3.92200, 250=3.51920, 500=3.39200, 1000=2.81960 (USD); Case/Package: VSSOP; Number of Pins: 10; Contact Plating: Gold; Min Operating Temperature: -40°C; Max Operating Temperature: 125°C; Interface: I2C; Package Quantity: 2500; Packaging: Tape and Reel; Supply Type: Single; Number of Converters: 1; Max Supply Voltage (DC): 5.5V; Min Supply Voltage (DC): 2V; Series: -; Radiation Hardening: No; RoHS Compliant: Yes; Lead Free: Lead Free; REACH SVHC: No SVHC; ComponentLink1URL: https://datasheet.ciiva.com/4031/47725463s8438921n7713-4031028.pdf?src-supplier=Arrow+Electronics; ComponentLink1Description: https://datasheet.ciiva.com/4031/47725463s8438921n7713-4031028.pdf?src-supplier=Arrow+Electronics; ComponentLink2URL: https://datasheet.ciiva.com/1304/ads1113-1304266.pdf?src-supplier=Digi-Key; ComponentLink2Description: https://datasheet.ciiva.com/1304/ads1113-1304266.pdf?src-supplier=Digi-Key; ComponentLink3URL: https://datasheet.ciiva.com/25993/sbas444b-25993205.pdf?src-supplier=Avnet+Europe; ComponentLink3Description: https://datasheet.ciiva.com/25993/sbas444b-25993205.pdf?src-supplier=Avnet+Europe; Manufacturer Part Number: ADS1115IDGST; Supplier Part Number 1: 296-24934-1-ND

## Sheet Connectors.SchDoc
size A4; SheetNumber: 3; SheetTotal: 3
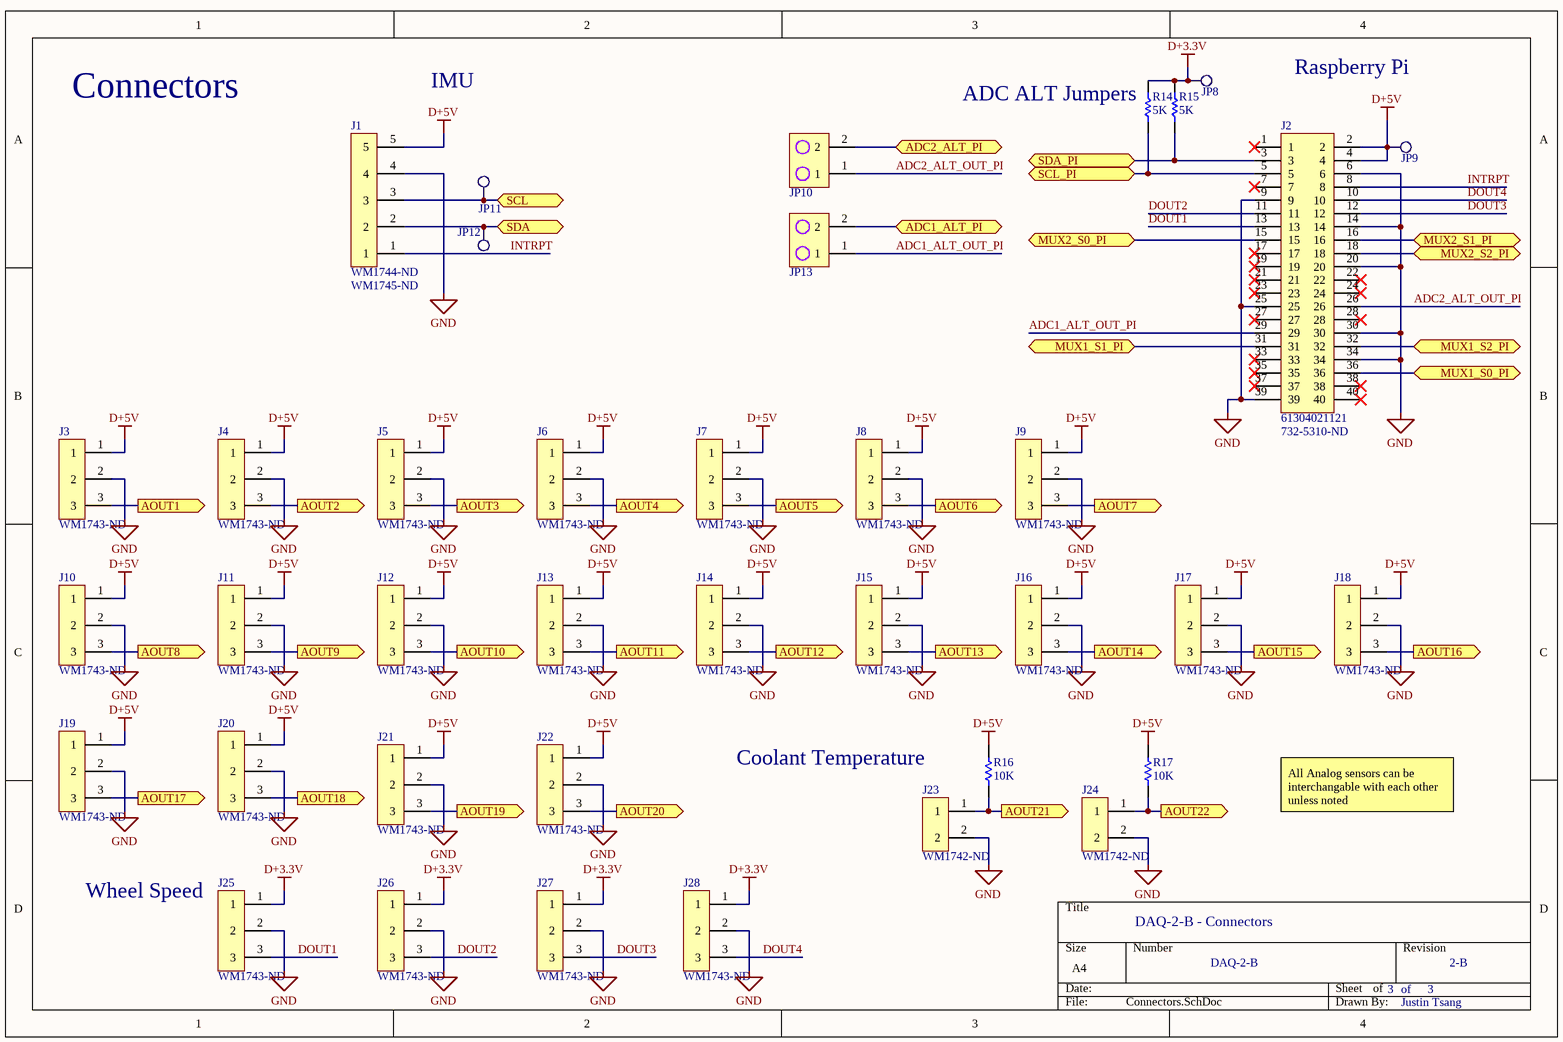
[diagram p2: Connectors.SchDoc]

### Parts
J1  WM1744-ND  Supplier Part Number 1: WM1745-ND  [1X5_1.25MM]
J2  61304021121  Supplier Part Number 1: 732-5310-ND  [2x40_Header]
J3  WM1743-ND  [1X3_1.25MM]
J4  WM1743-ND  [1X3_1.25MM]
J5  WM1743-ND  [1X3_1.25MM]
J6  WM1743-ND  [1X3_1.25MM]
J7  WM1743-ND  [1X3_1.25MM]
J8  WM1743-ND  [1X3_1.25MM]
J9  WM1743-ND  [1X3_1.25MM]
J10  WM1743-ND  [1X3_1.25MM]
J11  WM1743-ND  [1X3_1.25MM]
J12  WM1743-ND  [1X3_1.25MM]
J13  WM1743-ND  [1X3_1.25MM]
J14  WM1743-ND  [1X3_1.25MM]
J15  WM1743-ND  [1X3_1.25MM]
J16  WM1743-ND  [1X3_1.25MM]
J17  WM1743-ND  [1X3_1.25MM]
J18  WM1743-ND  [1X3_1.25MM]
J19  WM1743-ND  [1X3_1.25MM]
J20  WM1743-ND  [1X3_1.25MM]
J21  WM1743-ND  [1X3_1.25MM]
J22  WM1743-ND  [1X3_1.25MM]
J23  WM1742-ND  [1X2_1.25MM]
J24  WM1742-ND  [1X2_1.25MM]
J25  WM1743-ND  [1X3_1.25MM]
J26  WM1743-ND  [1X3_1.25MM]
J27  WM1743-ND  [1X3_1.25MM]
J28  WM1743-ND  [1X3_1.25MM]
JP8  Testpoint2  [TP2]  (value not drawn)
JP9  Testpoint2  [TP2]  (value not drawn)
JP10  732-5315-ND  [2PIN-JP]  (value not drawn)
JP11  Testpoint2  [TP2]  (value not drawn)
JP12  Testpoint2  [TP2]  (value not drawn)
JP13  732-5315-ND  [2PIN-JP]  (value not drawn)
R14  5K  [RES-0603]
R15  5K  [RES-0603]
R16  10K  [RES-0603]
R17  10K  [RES-0603]

### Ports
ADC1_ALT_PI (bidir), ADC2_ALT_PI (bidir), AOUT1 (out), AOUT2 (out), AOUT3 (out), AOUT4 (out), AOUT5 (out), AOUT6 (out), AOUT7 (out), AOUT8 (out), AOUT9 (out), AOUT10 (out), AOUT11 (out), AOUT12 (out), AOUT13 (out), AOUT14 (out), AOUT15 (out), AOUT16 (out), AOUT17 (out), AOUT18 (out), AOUT19 (out), AOUT20 (out), AOUT21 (out), AOUT22 (out), MUX1_S0_PI (bidir), MUX1_S1_PI (bidir), MUX1_S2_PI (bidir), MUX2_S0_PI (bidir), MUX2_S1_PI (bidir), MUX2_S2_PI (bidir), SCL (bidir), SCL_PI (bidir), SDA (bidir), SDA_PI (bidir)

### Nets
D+3.3V: J25.1 J26.1 J27.1 J28.1 JP8.1 R14.2 R15.2
D+5V: J1.5 J2.2 J2.4 J3.1 J4.1 J5.1 J6.1 J7.1 J8.1 J9.1 J10.1 J11.1 J12.1 J13.1 J14.1 J15.1 J16.1 J17.1 J18.1 J19.1 J20.1 J21.1 J22.1 JP9.1 R16.2 R17.2
GND: J1.4 J2.6 J2.9 J2.14 J2.20 J2.25 J2.30 J2.34 J2.39 J3.2 J4.2 J5.2 J6.2 J7.2 J8.2 J9.2 J10.2 J11.2 J12.2 J13.2 J14.2 J15.2 J16.2 J17.2 J18.2 J19.2 J20.2 J21.2 J22.2 J23.2 J24.2 J25.2 J26.2 J27.2 J28.2
ADC1_ALT_OUT_PI: J2.29 JP13.1
ADC2_ALT_OUT_PI: J2.26 JP10.1
DOUT1: J2.13 J25.3
DOUT2: J2.11 J26.3
DOUT3: J2.12 J27.3
DOUT4: J2.10 J28.3
INTRPT: J1.1 J2.8
SCL: J1.2 JP12.1 ; port SDA
SDA: J1.3 JP11.1 ; port SCL
NetJ2_3: J2.3 R15.1 ; port SDA_PI
NetJ2_5: J2.5 R14.1 ; port SCL_PI
NetJ2_15: J2.15 ; port MUX2_S0_PI
NetJ2_16: J2.16 ; port MUX2_S1_PI
NetJ2_18: J2.18 ; port MUX2_S2_PI
NetJ2_31: J2.31 ; port MUX1_S1_PI
NetJ2_32: J2.32 ; port MUX1_S2_PI
NetJ2_36: J2.36 ; port MUX1_S0_PI
NetJ3_3: J3.3 ; port AOUT1
NetJ4_3: J4.3 ; port AOUT2
NetJ5_3: J5.3 ; port AOUT3
NetJ6_3: J6.3 ; port AOUT4
NetJ7_3: J7.3 ; port AOUT5
NetJ8_3: J8.3 ; port AOUT6
NetJ9_3: J9.3 ; port AOUT7
NetJ10_3: J10.3 ; port AOUT8
NetJ11_3: J11.3 ; port AOUT9
NetJ12_3: J12.3 ; port AOUT10
NetJ13_3: J13.3 ; port AOUT11
NetJ14_3: J14.3 ; port AOUT12
NetJ15_3: J15.3 ; port AOUT13
NetJ16_3: J16.3 ; port AOUT14
NetJ17_3: J17.3 ; port AOUT15
NetJ18_3: J18.3 ; port AOUT16
NetJ19_3: J19.3 ; port AOUT17
NetJ20_3: J20.3 ; port AOUT18
NetJ21_3: J21.3 ; port AOUT19
NetJ22_3: J22.3 ; port AOUT20
NetJ23_1: J23.1 R16.1 ; port AOUT21
NetJ24_1: J24.1 R17.1 ; port AOUT22
NetJP10_2: JP10.2 ; port ADC2_ALT_PI
NetJP13_2: JP13.2 ; port ADC1_ALT_PI

Not connected (* = marked no-connect by the designer): J2 1* 7* 17* 19* 21* 22* 23* 24* 27* 28* 33* 35* 37* 38* 40*

### Notes on the sheet
- Connectors
- IMU
- (near JP10) ADC ALT Jumpers
- Raspberry Pi
- Coolant Temperature
- All Analog sensors can be interchangable with each other unless noted
- (near J25) Wheel Speed
- DAQ-2-B - Connectors
- DAQ-2-B
- of
- 2-B
- Justin Tsang

### Library data of the parts
J1 = CONN_1X5_1.25MM: CONN HEADER R/A 5POS 1.25MM; Supplier 1: Digi-Key
J2 = CONN_2X40: CONN HEADER VERT 40POS 2.54MM; Supplier 1: Digi-Key
J3-J22 J25-J28 = CONN_1X3_1.25MM: CONN HEADER R/A 3POS 1.25MM; Supplier 1: Digi-Key; Supplier Part Number 1: WM1743-ND
J23 J24 = CONN_1X2_1.25MM: CONN HEADER R/A 2POS 1.25MM; Supplier 1: Digi-Key; Supplier Part Number 1: WM1742-ND
JP8 JP9 JP11 JP12 = Testpoint2: Single layer pad TP
JP10 JP13 = 2PIN-TEST: CONN HEADER VERT 2POS 2.54MM
R14 R15 = 0603-5KR: as R4 on sheet ADC_Level; Supplier 1: Digi-Key; Stock 1: 70557; Pricing 1: 1=0.1, 10=0.02, 25=0.0144, 50=0.011, 100=0.0082, 250=0.00624, 500=0.00498, 1000=0.00367 (USD); Mount: Surface Mount; Case/Package: 0603; Case Code (Imperial): 0603; Case Code (Metric): 1608; Contact Plating: Tin; Min Operating Temperature: -55°C; Max Operating Temperature: 155°C; Tolerance: 1%; Packaging: Tape and Reel; Package Quantity: 1; Composition: Thick Film; Termination: SMD/SMT; Number of Terminations: 2; Max Power Dissipation: 100mW; Features: Moisture Resistant; Length: 0.063inch; Height: 0.022inch; Width: 0.8mm; Thickness: 457um; Radiation Hardening: No; ComponentLink1URL: https://www.bourns.com/docs/Product-Datasheets/CHPREZTR.pdf?src-supplier=Digi-Key; ComponentLink1Description: https://www.bourns.com/docs/Product-Datasheets/CHPREZTR.pdf?src-supplier=Digi-Key; ComponentLink2URL: http://www.bourns.com/pdfs/chpreztr.pdf?src-supplier=Avnet; ComponentLink2Description: http://www.bourns.com/pdfs/chpreztr.pdf?src-supplier=Avnet; Supplier Part Number 1: CR0603-FX-4991ELFDKR-ND
R16 R17 = 0603-10KR: RES SMD 10K OHM 5% 1/10W 0603; Manufacturer: Yageo; Manufacturer Part Number: RC0603JR-0710KL; Resistance: 10kR; Voltage Rating (DC): 50V; Temperature Coefficient: 100ppm/°C; Power Rating: 100mW; Supplier 1: Digi-Key; Stock 1: 3006558; Pricing 1: 1=0.1, 10=0.019, 100=0.0077, 1000=0.00347, 2500=0.00301 (USD); Case/Package: 0603; Number of Pins: 2; Contact Plating: Tin,Matte; Case Code (Imperial): 0603; Case Code (Metric): 1608; Min Operating Temperature: -55°C; Max Operating Temperature: 155°C; Packaging: Tape and Reel; Tolerance: 5%; Composition: Thick Film; Voltage Rating: 50V; Termination: SMD/SMT; Military Standard: Not; Features: Moisture Resistant; Max Power Dissipation: 100mW; Number of Terminations: 2; Length: 0.063inch; Width: 0.031inch; Depth: 0.8mm; Height - Seated (Max): 0.022inch; Radiation Hardening: No; REACH SVHC: Unknown; Lead Free: Lead Free; ComponentLink1URL: http://www.yageo.com/documents/recent/PYu-RC_Group_51_RoHS_L_10.pdf?src-supplier=Digi-Key; ComponentLink1Description: http://www.yageo.com/documents/recent/PYu-RC_Group_51_RoHS_L_10.pdf?src-supplier=Digi-Key; Supplier Part Number 1: 311-10KGRDKR-ND

## Nets that join several sheets
D+3.3V: ADC_Level (C3.2 R3.1 U1.3 U2.2), Connectors (7 pins)
D+5V: ADC_Level (25 pins), Connectors (26 pins)
GND: root (5 pins), ADC_Level (28 pins), Connectors (35 pins)
NetJ2_3: ADC_Level (U2.12), Connectors (J2.3 R15.1)
NetJ2_5: ADC_Level (U2.11), Connectors (J2.5 R14.1)
NetJ2_15: ADC_Level (U2.10), Connectors (J2.15)
NetJ2_16: ADC_Level (U2.9), Connectors (J2.16)
NetJ2_18: ADC_Level (U2.8), Connectors (J2.18)
NetJ2_31: ADC_Level (U2.4), Connectors (J2.31)
NetJ2_32: ADC_Level (U2.5), Connectors (J2.32)
NetJ2_36: ADC_Level (U2.3), Connectors (J2.36)
NetJ3_3: ADC_Level (U7.1), Connectors (J3.3)
NetJ4_3: ADC_Level (U7.2), Connectors (J4.3)
NetJ5_3: ADC_Level (U7.4), Connectors (J5.3)
NetJ6_3: ADC_Level (U7.5), Connectors (J6.3)
NetJ7_3: ADC_Level (U7.15), Connectors (J7.3)
NetJ8_3: ADC_Level (U7.14), Connectors (J8.3)
NetJ9_3: ADC_Level (U7.13), Connectors (J9.3)
NetJ10_3: ADC_Level (U7.12), Connectors (J10.3)
NetJ11_3: ADC_Level (U3.15), Connectors (J11.3)
NetJ12_3: ADC_Level (U3.14), Connectors (J12.3)
NetJ13_3: ADC_Level (U3.13), Connectors (J13.3)
NetJ14_3: ADC_Level (U3.12), Connectors (J14.3)
NetJ15_3: ADC_Level (U3.4), Connectors (J15.3)
NetJ16_3: ADC_Level (U3.5), Connectors (J16.3)
NetJ17_3: ADC_Level (U6.1), Connectors (J17.3)
NetJ18_3: ADC_Level (U6.2), Connectors (J18.3)
NetJ19_3: ADC_Level (U6.4), Connectors (J19.3)
NetJ20_3: ADC_Level (U6.5), Connectors (J20.3)
NetJ21_3: ADC_Level (U6.15), Connectors (J21.3)
NetJ22_3: ADC_Level (U6.14), Connectors (J22.3)
NetJ23_1: ADC_Level (U6.13), Connectors (J23.1 R16.1)
NetJ24_1: ADC_Level (U6.12), Connectors (J24.1 R17.1)
NetJP10_2: ADC_Level (U2.7), Connectors (JP10.2)
NetJP13_2: ADC_Level (U2.6), Connectors (JP13.2)
SCL: ADC_Level (R12.1 U2.14 U4.10 U5.10), Connectors (J1.2 JP12.1)
SDA: ADC_Level (R13.2 U2.13 U4.9 U5.9), Connectors (J1.3 JP11.1)